# Altium schematic sheet Calibres.SchDoc
size A4; SheetNumber: 10; SheetTotal: 10
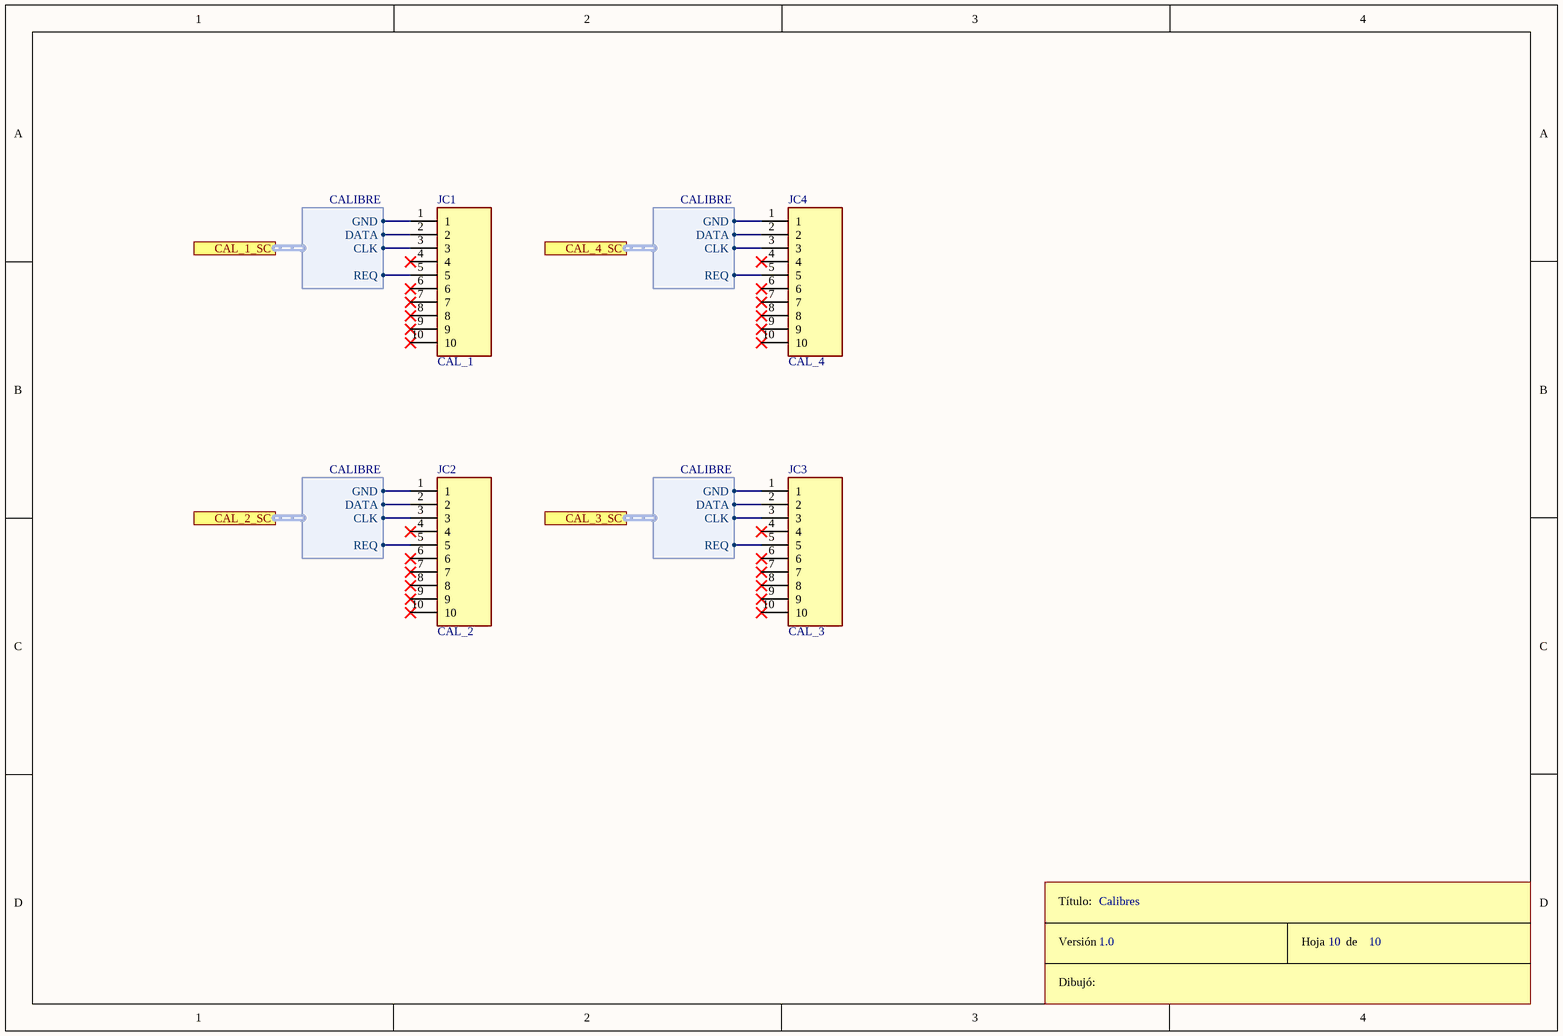
[diagram p0: Calibres.SchDoc]

## Parts
JC1  CAL_1  [TE_5104338-1 - 90DEG]
JC2  CAL_2  [TE_5104338-1 - 90DEG]
JC3  CAL_3  [TE_5104338-1 - 90DEG]
JC4  CAL_4  [TE_5104338-1 - 90DEG]
ROT10  Rótulo  (value not drawn)  (graphical)

## Ports
CAL_1_SC (harness CALIBRE), CAL_2_SC (harness CALIBRE), CAL_3_SC (harness CALIBRE), CAL_4_SC (harness CALIBRE)

## Harnesses
CALIBRE: CLK, DATA, GND, REQ

## Nets
NetJC1_1: JC1.1 ; port CAL_1_SC.GND
NetJC1_2: JC1.2 ; port CAL_1_SC.DATA
NetJC1_3: JC1.3 ; port CAL_1_SC.CLK
NetJC1_5: JC1.5 ; port CAL_1_SC.REQ
NetJC2_1: JC2.1 ; port CAL_2_SC.GND
NetJC2_2: JC2.2 ; port CAL_2_SC.DATA
NetJC2_3: JC2.3 ; port CAL_2_SC.CLK
NetJC2_5: JC2.5 ; port CAL_2_SC.REQ
NetJC3_1: JC3.1 ; port CAL_3_SC.GND
NetJC3_2: JC3.2 ; port CAL_3_SC.DATA
NetJC3_3: JC3.3 ; port CAL_3_SC.CLK
NetJC3_5: JC3.5 ; port CAL_3_SC.REQ
NetJC4_1: JC4.1 ; port CAL_4_SC.GND
NetJC4_2: JC4.2 ; port CAL_4_SC.DATA
NetJC4_3: JC4.3 ; port CAL_4_SC.CLK
NetJC4_5: JC4.5 ; port CAL_4_SC.REQ

Not connected (* = marked no-connect by the designer): JC1 4* 6* 7* 8* 9* 10*; JC2 4* 6* 7* 8* 9* 10*; JC3 4* 6* 7* 8* 9* 10*; JC4 4* 6* 7* 8* 9* 10*

## Notes on the sheet
- Calibres
- 1.0
- 10
- (in symbol Rótulo) Título:; Versión; Hoja       de; Dibujó:

## Library data of the parts
JC1-JC4 = 5104338-1: HEADER; PIN; AMP-LATCH; 10 POS; 2.54 X 2.54; VERTICAL; LOW PROFILE; PCB; MF: TE Connectivity; Price: None; Value: *; MP: 5104338-1; Availability: Unavailable; SnapEDA_Link: https://www.snapeda.com/parts/5104338-1/TE%20Connectivity%20AMP%20Connectors/view-part/2881080/?ref=snap; TE_purchase_URL: https://www.te.com/usa-en/product-5104338-1.html?te_bu=Cor&te_type=disp&te_campaign=seda_glo_cor-seda-global-disp-prtnr-fy19-seda-model-bom-cta_sma-317_1&elqCampaignId=32493; Package: None